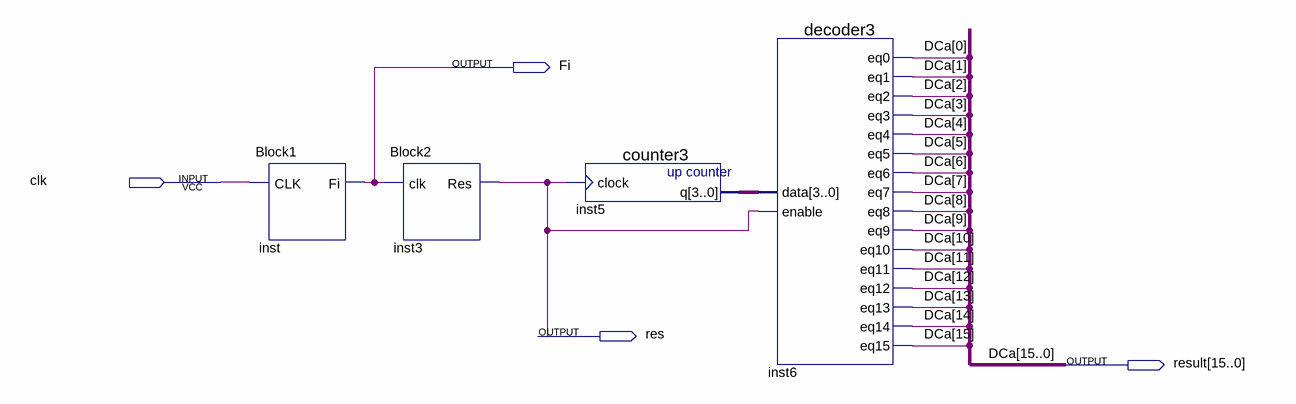
[diagram p0: schematic sheet]
// Quartus schematic Block3.bdf as structural Verilog: 4 symbols, 4 pins
module Block3 (
  input  clk,
  output Fi,
  output res,
  output [15:0] result
);

  wire [3:0] inst5_q;

  Block1 inst (.CLK(clk), .Fi(Fi));
  Block2 inst3 (.clk(Fi), .Res(res));
  counter3 inst5 (.clock(res), .q(inst5_q));
  decoder3 inst6 (
    .data(inst5_q), .enable(res), .eq0(result[0]), .eq1(result[1]), .eq2(result[2]), .eq3(result[3]),
    .eq4(result[4]), .eq5(result[5]), .eq6(result[6]), .eq7(result[7]), .eq8(result[8]), .eq9(result[9]),
    .eq10(result[10]), .eq11(result[11]), .eq12(result[12]), .eq13(result[13]), .eq14(result[14]),
    .eq15(result[15]));

  // Other names for the same wires on the sheet: DCa[15:0] = result
endmodule
